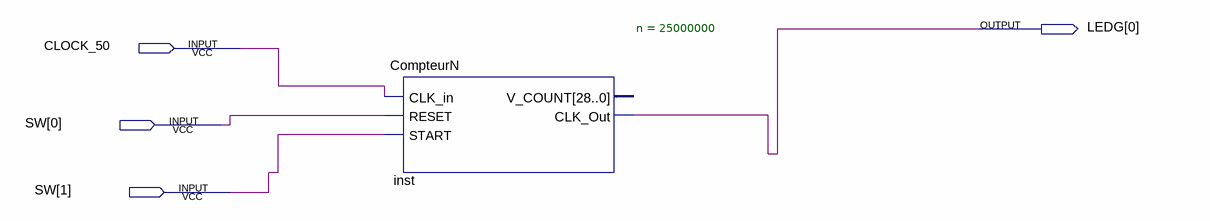
[diagram p0: schematic sheet]
// Quartus schematic compteurNShema.bdf as structural Verilog: 1 symbols, 4 pins
module compteurNShema (
  input  CLOCK_50,
  input  [1:0] SW,
  output [0:0] LEDG
);

  CompteurN #(.n(25000000)) inst (.CLK_in(CLOCK_50), .RESET(SW[0]), .START(SW[1]), .CLK_Out(LEDG[0]));  // open: V_COUNT
endmodule
